# EAGLE design Side_Long (EAGLE 9.4.2)
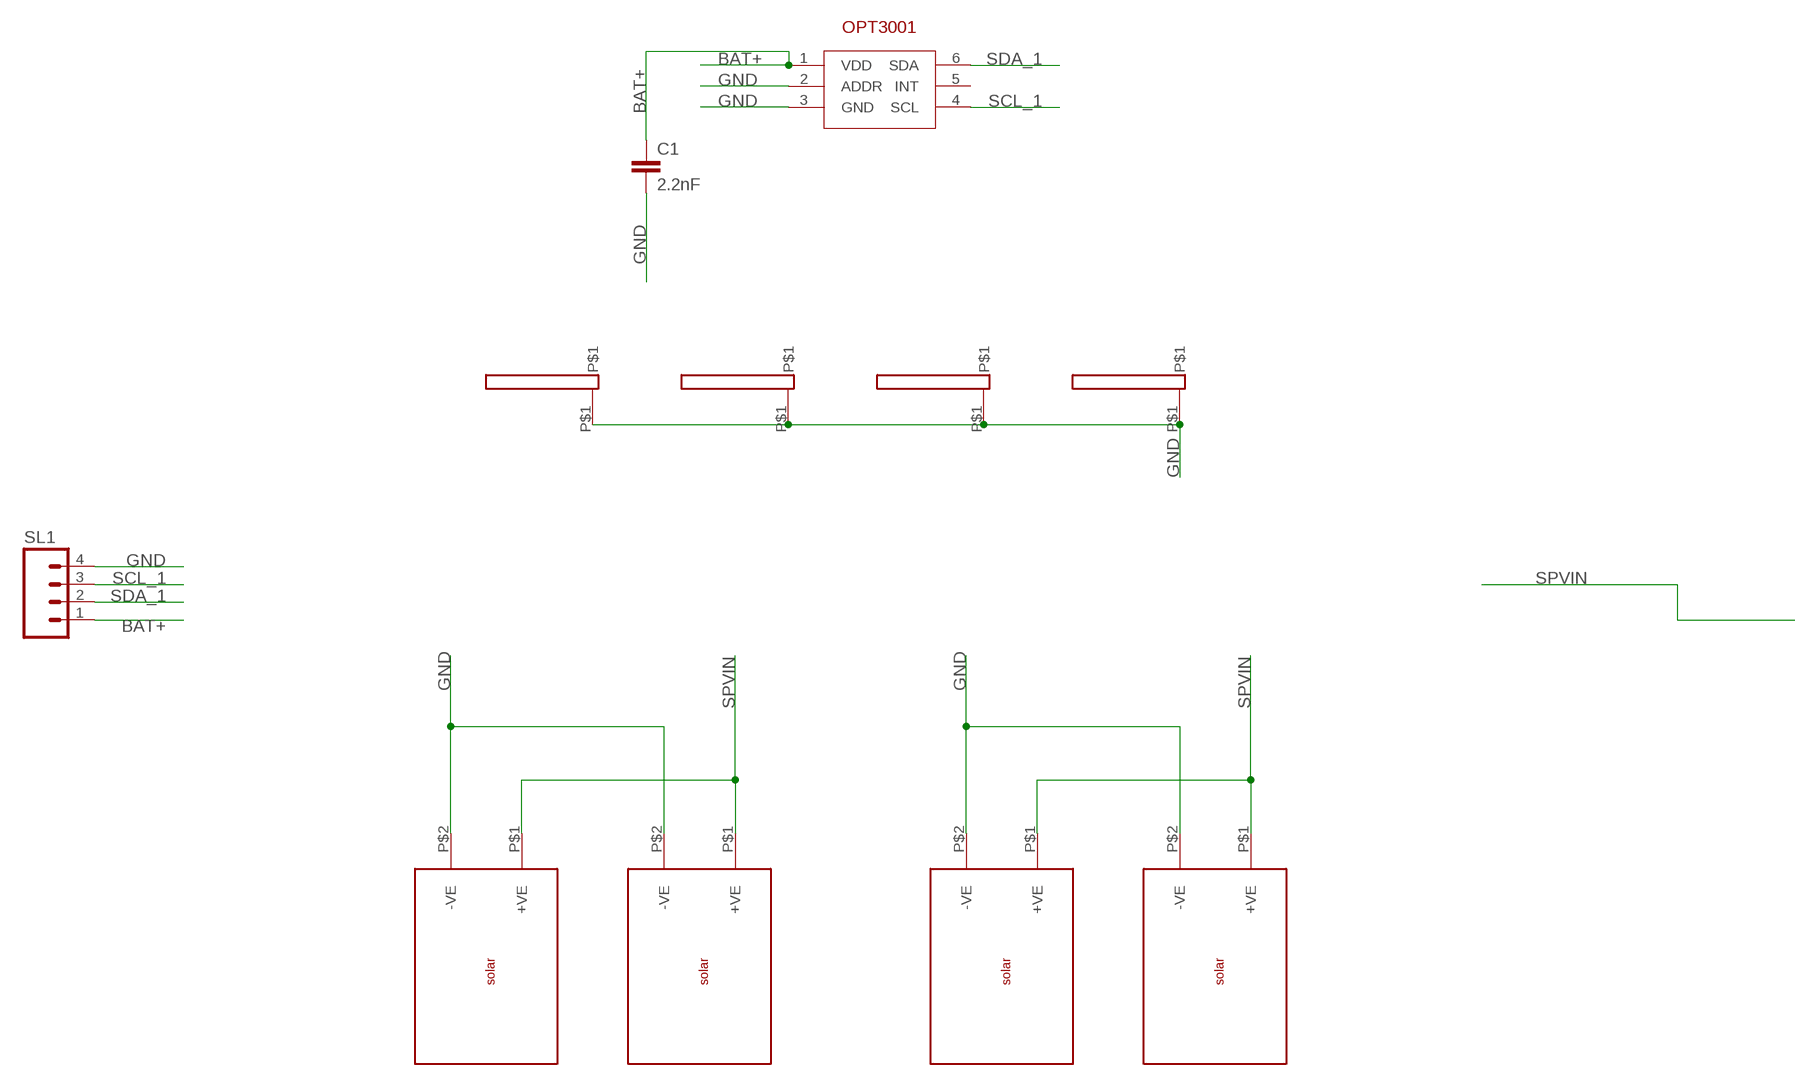
[diagram p0: schematic, sheet 1, part 1 of 2]
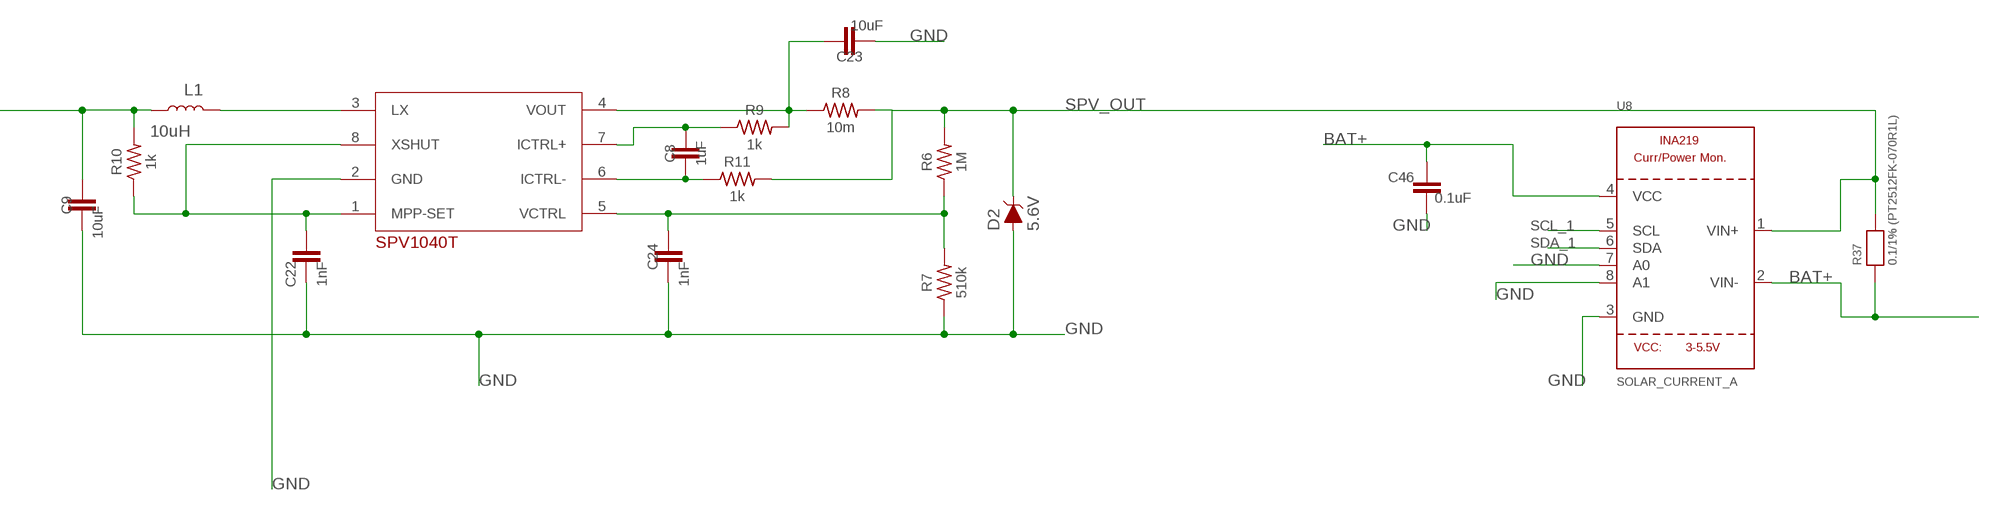
[diagram p1: schematic, sheet 1, part 2 of 2]

## Parts
C1  2.2nF  2.2NF/2200PF-0603-50V-10%  [0603]
C8  1uF  10UF-0603-6.3V-20%  [0603]
C9  10uF  10UF-0603-6.3V-20%  [0603]
C22  1nF  10UF-0603-6.3V-20%  [0603]
C23  10uF  10UF-0603-6.3V-20%  [0603]
C24  1nF  10UF-0603-6.3V-20%  [0603]
C46  0.1uF  10UF-0603-6.3V-20%  [0603]
D2  5.6V  DIODE-ZENER-MMSZ5232BS  [SOD-323]
L1  10uH  INDUCTOR-0603-33NH  [0603]
R6  1M  RC0603JR-070RL  [RES_0603]
R7  510k  RC0603JR-070RL  [RES_0603]
R8  10m  RC0603JR-070RL  [RES_0603]
R9  1k  RC0603JR-070RL  [RES_0603]
R10  1k  RC0603JR-070RL  [RES_0603]
R11  1k  RC0603JR-070RL  [RES_0603]
R37  0.1/1% (PT2512FK-070R1L)  RESISTOR2512  [2512]
SL1  M04  [04P]
SPV_A  SPV1040T_  [SOP65P640X120-8N]
U1  SON65P200X200X65-7N  [SON65P200X200X65-7N]
U8  SOLAR_CURRENT_A  INA219  [SOT23-8]
U$1  SOLAR_50_5_2  [FOOT]
U$2  SOLAR_50_5_2  [FOOT]
U$3  16X2  [16X2]
U$4  16X2  [16X2]
U$5  16X2  [16X2]
U$6  16X2  [16X2]
U$7  SOLAR_50_5_2  [FOOT]
U$8  SOLAR_50_5_2  [FOOT]

## Nets
BAT+: C1.1 C46.1 R37.1 SL1.1 U1.1(VDD) U8.2(VIN-) U8.4(VCC)
GND [vcc]: C1.2 C9.2 C22.2 C23.2 C24.2 C46.2 D2.A R7.1 SL1.4 SPV_A.2(GND) U1.2(ADDR) U1.3(GND) U8.3(GND) U8.7(A0) U8.8(A1) U$1.P$2(-VE) U$2.P$2(-VE) U$3.P$1 U$4.P$1 U$5.P$1 U$6.P$1 U$7.P$2(-VE) U$8.P$2(-VE)
N$5: L1.2 SPV_A.3(LX)
N$31: C22.1 R10.1 SPV_A.1(MPP-SET) SPV_A.8(XSHUT)
N$32: C24.1 R6.1 R7.2 SPV_A.5(VCTRL)
N$34: C8.2 R11.1 SPV_A.6(ICTRL-)
N$35: C8.1 R9.1 SPV_A.7(ICTRL+)
N$36: C23.1 R8.1 R9.2 SPV_A.4(VOUT)
SCL_1: SL1.3 U1.4(SCL) U8.5(SCL)
SDA_1: SL1.2 U1.6(SDA) U8.6(SDA)
SPV_OUT: D2.C R6.2 R8.2 R11.2 R37.2 U8.1(VIN+)
SPVIN: C9.1 L1.1 R10.2 U$1.P$1(+VE) U$2.P$1(+VE) U$7.P$1(+VE) U$8.P$1(+VE)
Unconnected: U1.5(INT)

## Library data of the parts
C1 = SparkFun-Capacitors:2.2NF/2200PF: 2.2nF/2,200pF ceramic capacitors A capacitor is a passive two-terminal electrical component used to store electrical energy temporarily in an electric field.; PROD_ID: CAP-07877
C8 C22 C24 C46 = SparkFun-Capacitors:10UF: 10.0µF ceramic capacitors A capacitor is a passive two-terminal electrical component used to store electrical energy temporarily in an electric field.; PROD_ID: CAP-11015; VALUE: 10uF
C9 C23 = SparkFun-Capacitors:10UF: 10.0µF ceramic capacitors A capacitor is a passive two-terminal electrical component used to store electrical energy temporarily in an electric field.; PROD_ID: CAP-11015
D2 = SparkFun-DiscreteSemi:DIODE-ZENER: Zener Diode A Zener diode allows current to flow from its anode to its cathode like a normal semiconductor diode, but it also permits current to flow in the reverse direction when its "Zener voltage" is reached. - WIkipedia; PROD_ID: DIO-12442
L1 = SparkFun-Coils:INDUCTOR: Inductors Resist changes in electrical current. Basically a coil of wire. SparkFun Products: SparkFun Load Cell Amplifier - HX711 <https://www.sparkfun.com/products/13879> IOIO-OTG - V2.2 <https://www.sparkfun.com/products/13613>; PROD_ID: NDUC-07874; VALUE: 33nH/±5%/500mA
R6-R11 = Resistor_Capacitor:RC0603JR-070RL: RES SMD 0 OHM JUMPER 1/10W 0603 Manufacturer's datasheet <http://www.yageo.com/documents/recent/PYu-RC_Group_51_RoHS_L_10.pdf>; CREATED_BY: PCBLayout.com; DIGIKEY_PART_NUMBER: 311-0.0GRTR-ND; MANUFACTURER: Yageo; MPN: RC0603JR-070RL; PACKAGE: SMD 0603
R37 = microbuilder:RESISTOR: Resistors 0402 - 0402 Surface Mount Package 22 Ohm 1% 1/16W [Digikey: 311-22.0LRTR-ND] 33 Ohm 5% 1/16W 1.0K 5% 1/16W 1.5K 5% 1/16W 2.0K 1% 1/16W 10.0K 1% 1/16W [Digikey: 311-10.0KLRTR-ND] 10.0K 5% 1/16W [Digikey: RMCF0402JT10K0TR-ND] 12.1K 1% 1/16W [Digikey: 311-22.0LRTR-ND] 100.0K 5% 1/16W 0603 - 0603 Surface Mount Package 0 Ohm 1/10 Watt 1% Resistor 15 Ohm 1/10 Watt 1% Resistor 33 Ohm 1/10 Watt 1% Resistor 49.9 Ohm 1/10 Watt 1% Resistor 100 Ohm 1/10 Watt 1% Resistor 150 Ohm 1/10 Watt 1% Resistor 240 Ohm 1/10 Watt 1% Resistor 390 Ohm 1/10 Watt 1% Resistor 560 Ohm 1/10 Watt 1% Resistor 680 Ohm 1/10 Watt 1% Resistor 750 Ohm 1/10 Watt 1% Resistor 1.0K Ohm 1/10 Watt 1% Resistor 1.5K Ohm 1/10 Watt 1% Resistor 2.0K Ohm 1/10 Watt 1% Resistor 2.2K Ohm 1/10 Watt 1% Resistor 3.3K Ohm 1/10 Watt 1% Resistor 4.7K Ohm 1/10 Watt 1% Resistor 10.0K Ohm 1/10 Watt 1% Resistor 12.0K Ohm 1/10 Watt 1% Resistor 12.1K Ohm 1/10 Watt 1% Resistor 20.0K Ohm 1/10 Watt 1% Resistor 33.0K Ohm 1/10 Watt 1% Resistor 100.0K Ohm 1/10 Watt 1% Resistor 0805 - 0805 Surface Mount Package 0 Ohm 1/8 Watt 1% Resistor 33 Ohm 1/8 Watt 1% Resistor 100 Ohm 1/8 Watt 1% Resistor 150 Ohm 1/8 Watt 1% Resistor 200 Ohm 1/8 Watt 1% Resistor 240 Ohm 1/8 Watt 1% Resistor 330 Ohm 1/8 Watt 1% Resistor 390 Ohm 1/8 Watt 1% Resistor 470 Ohm 1/8 Watt 1% Resistor 1.0K Ohm 1/8 Watt 1% Resistor 1.5K Ohm 1/8 Watt 1% Resistor 2.0K Ohm 1/8 Watt 1% Resistor 4.7K Ohm 1/8 Watt 1% Resistor 5.1K Ohm 1/8 Watt 1% Resistor 5.6K Ohm 1/8 Watt 1% Resistor 10.0K Ohm 1/8 Watt 1% Resistor 22.0K Ohm 1/8 Watt 1% Resistor 33.0K Ohm 1/8 Watt 1% Resistor 100K Ohm 1/8 Watt 1% Resistor 1206 - 1206 Surface Mount Package 2012 - 2010 Surface Mount Package 0.11 Ohm 1/2 Watt 1% Resistor - Digikey: RHM.11UCT-ND
SL1 = con-amp-quick:M04: AMP QUICK CONNECTOR; OC_FARNELL: unknown; OC_NEWARK: unknown
SPV_A = SPV1040T:SPV1040T_
U1 = SON65P200X200X65-7N:SON65P200X200X65-7N; A_MAX: 0.65; B_MAX: 0.3; B_MIN: 0.2; B_NOM: 0.25; D2_NOM: 1.35; D_MAX: 2.075; D_MIN: 1.925; D_NOM: 2.0; E2_NOM: 0.65; ENOM: 0.65; E_MAX: 2.075; E_MIN: 1.925; E_NOM: 2.0; L_MAX: 0.35; L_MIN: 0.25; L_NOM: 0.3; MANUFACTURER: Maxim Integrated; PIN_COUNT: 6.0; SNAPEDA_PACKAGE_ID: 71138; STANDARD: IPC 7351B
U8 = microbuilder:INA219: INA219 - I2C Current/Power Monitor Voltage Range: 0-26V Accuracy: 0.5% Temperature: -40°C - 125°C
U$1 U$2 U$7 U$8 = solar_50_5_2:SOLAR_50_5_2
U$3-U$6 = 16x2PAD:16X2: Pad for 90 degree solder

## Net classes
1 vcc: width 0.254 mm

## Board
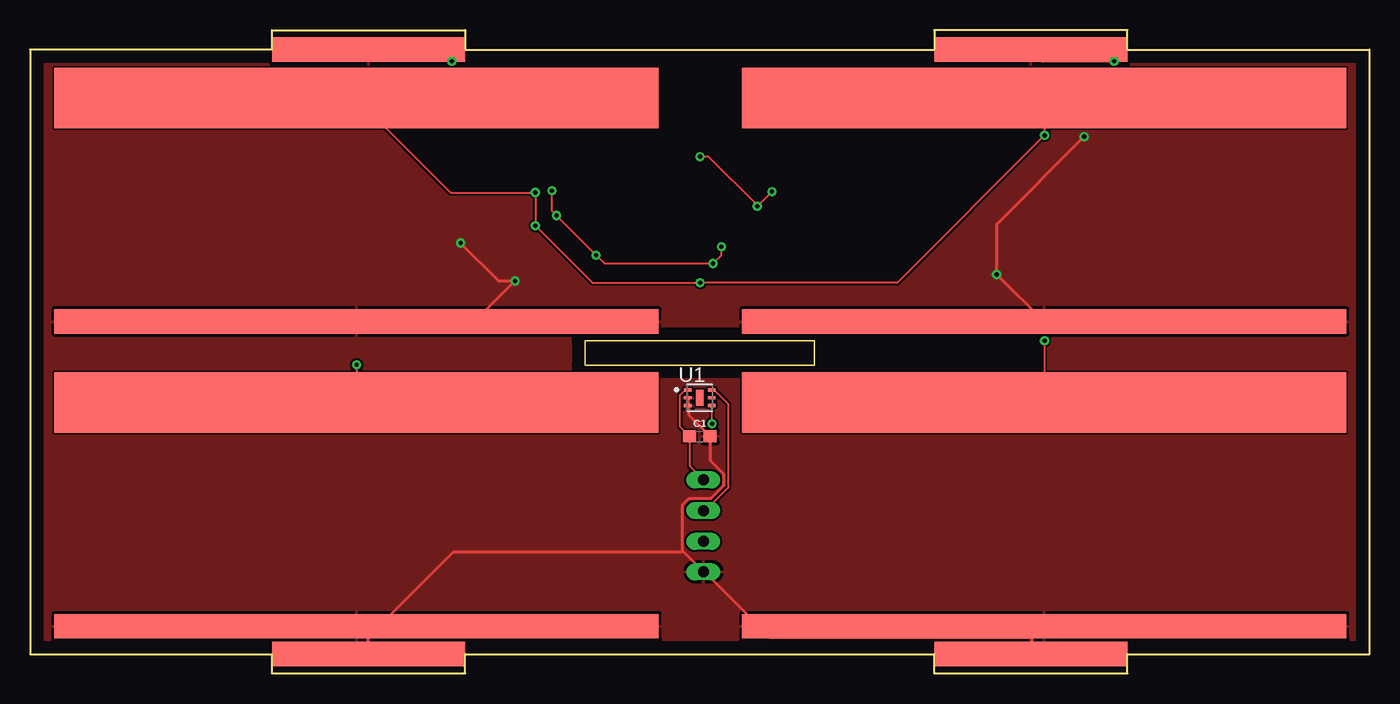
[diagram p2: board, top side]
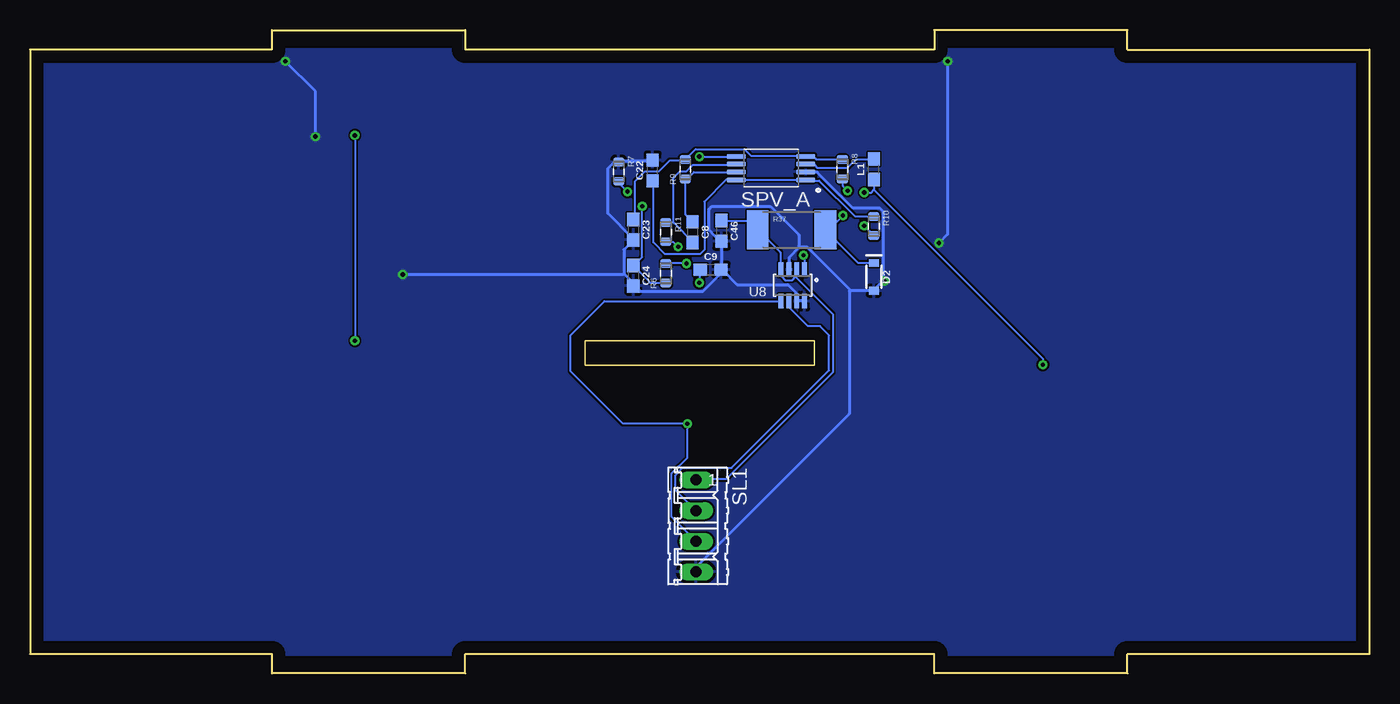
[diagram p3: board, bottom side, seen from below]

Size 110.8 x 53.2 mm. Coordinates in mm from the lower left corner, seen from the top.
Outline: 0,1.6 20,1.6 20,0 36,0 36,1.6 74.8,1.6 74.8,0 90.8,0 90.8,1.6 110.8,1.6 110.8,51.6 90.8,51.6 90.8,53.2 74.8,53.2 74.8,51.6 36,51.6 36,53.2 20,53.2 20,51.6 0,51.6 0,1.6
Outline: 64.9,27.5 45.9,27.5 45.9,25.5 64.9,25.5 64.9,27.5
Copper layers (1*16): Top 0.035mm / dielectric 1.5mm / Bottom 0.035mm
Design rules "default *": minimum track width 6mil, minimum drill 0.35mm, track to track 6mil, track to pad 6mil, pad to pad 6mil, via to via 6mil, smd to smd 6mil, copper to edge 40mil, drill to drill 6mil, minimum pad ring 10mil, minimum via ring 8mil, stop-mask expansion 4mil, vias tented up to drill 0mil, thermal gap 10mil

### Footprints (pad centres in the part's own frame; a part is rotated, then mirrored left to right if it is on the bottom)
0603 = smd 1.1 x 1: 1 -0.85,0; 2 0.85,0
SOD-323 = smd 0.63 x 0.83: A 1.15,0; C -1.15,0
RES_0603 = smd 0.74 x 0.93: 1 -0.795,0; 2 0.795,0
2512 = smd 1.8 x 3.2: 1 -2.8,0; 2 2.8,0
04P = drill 0.914 long: 1 -3.81,0; 2 -1.27,0; 3 1.27,0; 4 3.81,0
SOP65P640X120-8N = smd 1.56 x 0.41: 1 -2.88,0.975; 2 -2.88,0.325; 3 -2.88,-0.325; 4 -2.88,-0.975; 5 2.88,-0.975; 6 2.88,-0.325; 7 2.88,0.325; 8 2.88,0.975
SON65P200X200X65-7N = smd 0.72 x 0.27: 1 -0.995,0.65; 2 -0.995,0; 3 -0.995,-0.65; 4 0.995,-0.65; 5 0.995,0; 6 0.995,0.65 | smd 0.65 x 1.35: 7 0,0
SOT23-8 = smd 0.4 x 1.2: 1 -0.975,-1.3; 2 -0.325,-1.3; 3 0.325,-1.3; 4 0.975,-1.3; 5 0.975,1.3; 6 0.325,1.3; 7 -0.325,1.3; 8 -0.975,1.3
FOOT = smd 50 x 5: P$1 0,0 | smd 50 x 2: P$2 0,18.5
16X2 = smd 16 x 2: P$1 0,0

### Placement (x,y rotation side)
C1  55.4,19.6 0 top
C8  56,36.5 270 bottom
C9  54.5,33.4 0 bottom
C22  59.3,41.6 90 bottom
C23  60.9,36.7 270 bottom
C24  60.9,32.9 270 bottom
C46  53.6,36.6 270 bottom
D2  41,32.8 270 bottom
L1  41,41.7 90 bottom
R6  58.2,33.1 90 bottom
R7  62.1,41.5 270 bottom
R8  43.6,41.7 270 bottom
R9  56.6,41.7 90 bottom
R10  41,37 270 bottom
R11  58.2,36.5 270 bottom
R37  47.8,36.7 0 bottom
SL1  55.7,12.2 270 bottom
SPV_A  49.5,41.8 180 bottom
U1  55.4,22.8 0 top
U8  47.7,32.1 180 bottom
U$1  27,47.6 180 top
U$2  27,22.4 180 top
U$3  28,1.6 0 top
U$4  82.8,1.6 0 top
U$5  28,51.6 0 top
U$6  82.8,51.6 0 top
U$7  83.9,47.6 180 top
U$8  83.9,22.4 180 top

### Tracks (layer width: path | path; a pad name or v marks a point on that pad's centre or on a via)
BAT+
  Top 0.152: U1.1 54.37,23.39 54.14,23.39 53.76,23.01 53.76,20.42 54.52,19.66 C1.1 54.6,19.58 54.6,17.14 55.66,16.08 SL1.1
  Bottom 0.152: 47.47,32.8 47.74,32.54 48.35,32.54 48.65,32.84 48.65,33.38 U8.4 48.73,33.45 48.73,34.82 50.56,36.65 R37.1 50.63,36.73 51.32,37.41 53.53,37.41 C46.1 | 47.47,32.8 47.43,32.84 47.43,33.38 U8.2 | 47.47,32.8 44.39,29.72 44.39,24.92 53.23,16.08 55.66,16.08 SL1.1
GND  (via drill 0.35)
  Top 0.254: U$4.P$1 82.87,1.6 82.87,2.9 83.86,3.89 U$8.P$2 82.79,2.97 61.23,2.97 55.82,8.38 SL1.4 55.66,8.46 53.99,10.13 | U1.2 54.45,22.78 54.45,22.17 U1.3 54.52,22.1 54.52,21.34 56.2,19.66 C1.2 56.27,19.51 56.27,17.6 57.42,16.46 57.42,15.54 56.35,14.48 54.52,14.48 53.99,13.94 53.99,10.13 | U$3.P$1 27.93,1.6 27.93,2.97 27.01,3.89 U$2.P$2 28,3.05 35.01,10.06 53.91,10.06 53.99,10.13 | U$1.P$2 27.01,29.11 36.77,29.11 v40.12,32.46 38.74,32.46 v35.6,35.6 | U$7.P$2 83.86,29.11 v79.97,32.99 79.97,37.17 v87.2,44.4 | v89.69,50.63 83.77,50.63 U$6.P$1 | U$5.P$1 33.92,51.6 v34.89,50.63
  Bottom 0.254: 42.94,31.7 41.03,31.7 D2.A 40.96,31.78 40.2,32.54 | 42.94,31.7 46.52,35.28 47.13,35.28 | 47.13,35.28 47.97,34.44 47.97,33.45 U8.3 | 40.2,32.54 40.2,38.18 40.5,38.48 42.71,38.48 45.68,41.45 46.6,41.45 SPV_A.2 | U8.8 46.75,30.86 47.36,30.86 U8.7 47.43,30.94 47.43,31.47 48.12,32.16 52.31,32.16 53.53,33.38 C9.2 | C9.2 53.61,33.45 53.61,35.74 C46.2 54.12,36.15 54.64,36.68 54.64,38.4 54.41,38.63 49.57,38.63 47.21,36.27 47.21,35.36 47.13,35.28 | C22.2 59.32,42.44 59.4,42.37 62.06,42.37 R7.1 62.48,42.3 63,41.77 63,38.05 60.92,35.97 C23.2 60.92,35.81 61.68,35.05 61.68,33.07 | 61.68,33.07 60.92,32.31 60.92,32.08 C24.2 60.77,32.08 60.31,31.62 55.13,31.62 53.53,33.22 C9.2 | SL1.4 55.66,8.46 55.66,8.84 43.02,21.49 43.02,31.62 42.94,31.7 | v40.12,32.46 40.2,32.54 | v79.97,32.99 61.76,32.99 61.68,33.07 | v87.2,44.4 87.2,48.14 v89.69,50.63 | v34.89,50.63 34.89,36.31 v35.6,35.6
  pour Top: 0,1.6 0,51.6 110.8,51.6 110.8,1.6
  pour Bottom: 0,1.6 0,51.6 110.8,51.6 110.8,1.6
N$5
  Bottom 0.152: L1.2 41.03,42.52 42.48,42.52 43.17,41.83 45.68,41.83 45.91,42.06 46.6,42.06 SPV_A.3
N$31
  Bottom 0.152: R10.1 42.56,37.8 45.53,40.77 46.6,40.77 SPV_A.1 46.67,40.84 52.31,40.84 SPV_A.8 53.23,40.83 55.03,39.03 55.03,35.03 55.39,34.67 58.25,34.67 59.24,35.66 59.24,40.69 C22.1
N$32  (via drill 0.35)
  Top 0.152: v61.38,39.85 v60.16,38.63 60.16,38.71 56.12,42.75 v55.43,42.75
  Bottom 0.152: R6.1 58.25,32.31 59.47,32.31 60.84,33.68 C24.1 60.84,33.76 60.16,34.44 v60.16,38.63 | v61.38,39.85 62.06,40.54 62.06,40.69 R7.2 | v55.43,42.75 52.39,42.75 SPV_A.5
N$34
  Bottom 0.152: 57.51,37.22 56,35.72 C8.2 | 57.51,37.22 57.55,37.26 58.18,37.26 R11.1 | SPV_A.6 52.39,42.06 55.97,42.06 56.5,41.53 57.03,41.53 57.57,41 57.57,37.29 57.51,37.22
N$35
  Bottom 0.152: C8.1 56.05,37.41 56.58,37.95 56.58,40.84 R9.1 56.5,40.84 55.89,41.45 52.39,41.45 SPV_A.7
N$36
  Bottom 0.152: R8.1 43.62,42.52 45.76,42.52 45.99,42.75 46.6,42.75 SPV_A.4 46.67,42.82 51.17,42.82 51.7,43.36 55.74,43.36 56.58,42.52 R9.2 56.65,42.44 57.87,42.44 58.79,41.53 59.93,41.53 60.77,40.69 60.77,37.64 60.84,37.57 C23.1
SCL_1  (via drill 0.35)
  Top 0.152: v56.43,20.65 56.43,22.1 U1.4
  Bottom 0.152: SL1.3 55.74,10.97 57.72,12.95 57.72,16.54 56.43,17.83 v56.43,20.65 61.76,20.65 66.1,24.99 66.1,27.96 63.28,30.79 48.73,30.79 U8.5
SDA_1
  Top 0.152: U1.6 56.43,23.39 56.65,23.39 57.8,22.25 57.8,15.39 55.89,13.49 55.74,13.49 SL1.2
  Bottom 0.152: U8.6 47.97,30.79 47.97,30.25 46.44,28.73 45.45,28.73 44.69,27.96 44.69,25.07 52.77,16.99 56.81,16.99 57.42,16.38 57.42,15.16 55.74,13.49 SL1.2
SPV_OUT  (via drill 0.35)
  Top 0.152: v43.17,39.93 43.17,38.25 v43.55,37.87 v46.82,34.59 47.51,33.91 v56.5,33.91 57.19,34.59 v57.19,35.28
  Bottom 0.152: D2.C 41.03,33.98 42.33,33.98 45,36.65 R37.2 44.84,36.58 v43.55,37.87 | v43.17,39.93 43.55,40.31 43.55,40.84 R8.2 | v56.5,33.91 58.18,33.91 R6.2 | v57.19,35.28 57.57,35.66 58.18,35.66 R11.2 | v46.82,34.59 46.75,34.52 46.75,33.45 U8.1
SPVIN  (via drill 0.35)
  Top 0.152: U$1.P$1 27.01,47.55 34.78,39.78 v41.8,39.78 v41.8,37.03 46.52,32.31 v55.43,32.31 71.74,32.31 v83.93,44.5 83.93,47.55 U$7.P$1 | v27.01,25.53 27.01,22.4 U$2.P$1 | v83.93,27.51 83.93,22.4 U$8.P$1
  Bottom 0.152: v41.8,37.03 41.03,36.27 R10.2 | L1.1 41,40.01 40.98,40 | v41.8,39.78 41.2,39.78 40.98,40 | v55.43,32.31 55.36,32.38 55.36,33.38 C9.1 | 40.98,40 27.01,26.03 v27.01,25.53 | v83.93,44.5 v83.93,27.51